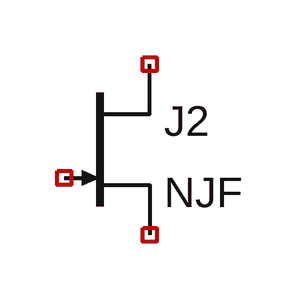
[diagram p0: schematic FET_VCCS.asc]
FET_VCCS.asc, the LTspice schematic file:
Version 4
SHEET 1 880 680
SYMBOL njf 240 64 R0
SYMATTR InstName J2

The netlist it stands for:
* FET_VCCS.asc
J2 NC_01 NC_02 NC_03 NJF
.model NJF NJF
.model PJF PJF
.lib standard.jft
.backanno
.end